# EAGLE design MSP-EXP430F5529LP (EAGLE 6.5.0)
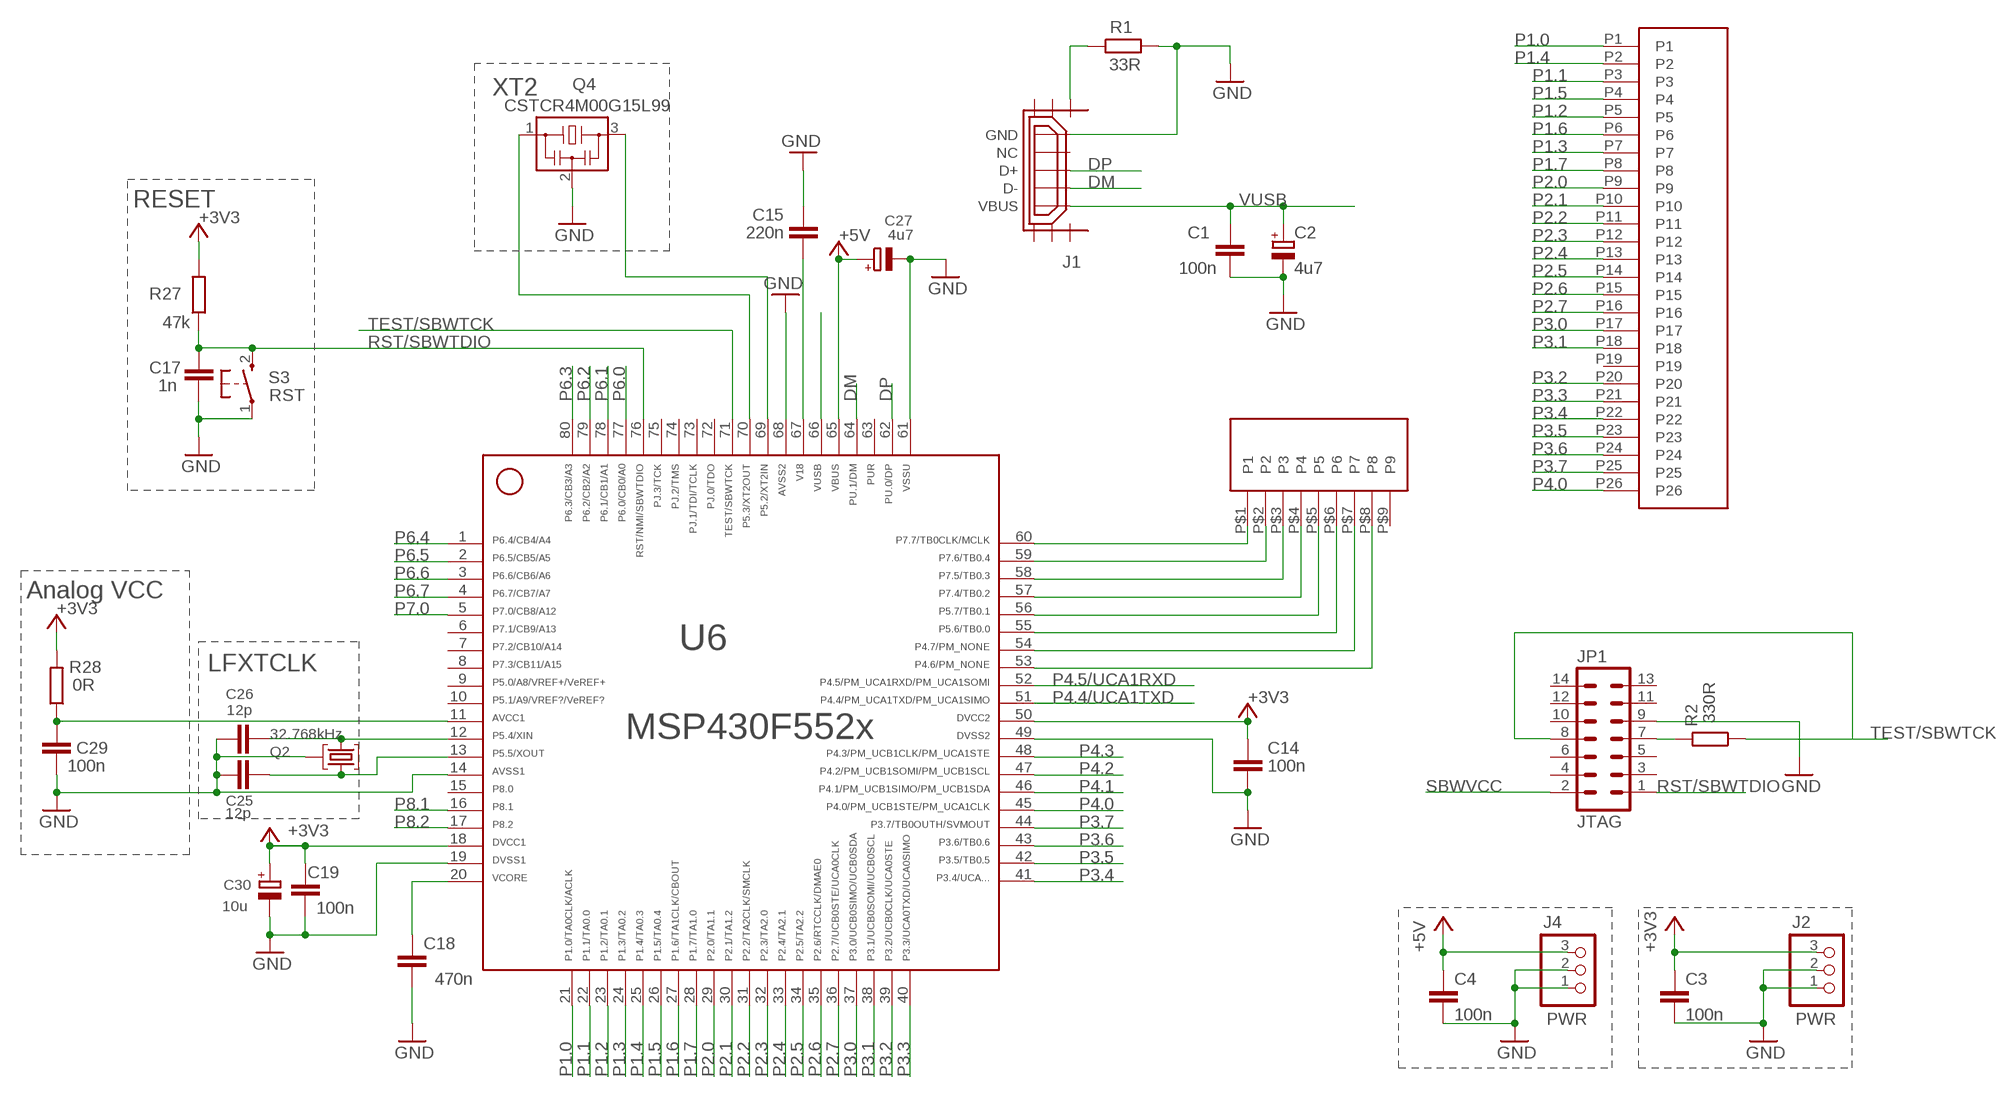
[diagram p0: schematic, sheet 1]

## Parts
C1  100n  C-EUC0402  [C0402]
C2  4u7  CPOL-EUA/3216-18R  [A/3216-18R]
C3  100n  C-EUC0402  [C0402]
C4  100n  C-EUC0402  [C0402]
C14  100n  C-EUC0402  [C0402]
C15  220n  C-EUC0402  [C0402]
C17  1n  C-EUC0402  [C0402]
C18  470n  C-EUC0402  [C0402]
C19  100n  C-EUC0402  [C0402]
C25  12p  C-EUC0402  [C0402]
C26  12p  C-EUC0402  [C0402]
C27  4u7  CPOL-EUA/3216-18R  [A/3216-18R]
C29  100n  C-EUC0402  [C0402]
C30  10u  CPOL-EUA/3216-18R  [A/3216-18R]
J1  USB_MICRO_FLIPPED  [HIROSE-ZX62R-B-5P]
J2  PWR  PINHD-1X3  [1X03]
J4  PWR  PINHD-1X3  [1X03]
JP1  JTAG  MA07-2  [MA07-2]
Q2  32.768kHz  MS3V-T1R  [MS3V-T1R]
Q4  CSTCR4M00G15L99  MURATA-FILTER_CSTCR6M00G53Z  [MURATA-FILTER_CSTCR]
R1  33R  R-EU_R0402  [R0402]
R2  330R  R-EU_R0402  [R0402]
R27  47k  R-EU_R0402  [R0402]
R28  0R  R-EU_R0402  [R0402]
S3  RST  PB  [PBTH]
U6  MSP430F5529IPNR  F552X---PN80  [PN80]
U$1  52806-0910  [SD-52806-09]
U$2  52808-267126  [SD-52808-025]

## Nets
+3V3 [Power]: C3.1 C14.1 C19.2 C30.+ J2.3 R27.2 R28.2 U6.18 U6.50
+5V [Power]: C4.1 C27.+ J4.3 U6.65
AVCC [Power]: C29.1 R28.1 U6.11
DM: J1.D- U6.64
DP: J1.D+ U6.62
GND [Ground]: C1.2 C2.- C3.2 C4.2 C14.2 C15.2 C17.2 C18.1 C19.1 C25.1 C26.1 C27.- C29.2 C30.- J1.GND J2.1 J2.2 J4.1 J4.2 JP1.9 Q2.P3(GND) Q4.2 R1.2 S3.1(P) U6.14 U6.19 U6.49 U6.61 U6.68
N$1: JP1.7 R2.2
N$9: U6.60 U$1.P$1(P1)
N$30: U6.59 U$1.P$2(P2)
N$31: U6.58 U$1.P$3(P3)
N$32: U6.57 U$1.P$4(P4)
N$33: U6.56 U$1.P$5(P5)
N$34: U6.55 U$1.P$6(P6)
N$35: U6.54 U$1.P$7(P7)
N$36: U6.53 U$1.P$8(P8)
N$39: J1.SHIELD1 R1.1
P1.0: U6.21 U$2.P1
P1.1: U6.22 U$2.P3
P1.2: U6.23 U$2.P5
P1.3: U6.24 U$2.P7
P1.4: U6.25 U$2.P2
P1.5: U6.26 U$2.P4
P1.6: U6.27 U$2.P6
P1.7: U6.28 U$2.P8
P2.0: U6.29 U$2.P9
P2.1: U6.30 U$2.P10
P2.2: U6.31 U$2.P11
P2.3: U6.32 U$2.P12
P2.4: U6.33 U$2.P13
P2.5: U6.34 U$2.P14
P2.6: U6.35 U$2.P15
P2.7: U6.36 U$2.P16
P3.0: U6.37 U$2.P17
P3.1: U6.38 U$2.P18
P3.2: U6.39 U$2.P20
P3.3: U6.40 U$2.P21
P3.4: U6.41 U$2.P22
P3.5: U6.42 U$2.P23
P3.6: U6.43 U$2.P24
P3.7: U6.44 U$2.P25
P4.0: U6.45 U$2.P26
P4.1: U6.46
P4.2: U6.47
P4.3: U6.48
P4.4/UCA1TXD: U6.51
P4.5/UCA1RXD: U6.52
P5.2/XT2IN: Q4.3 U6.69
P5.3/XT2OUT: Q4.1 U6.70
P5.4/XIN: C26.2 Q2.P2 U6.12
P5.5/XOUT: C25.2 Q2.P1 U6.13
P6.0: U6.77
P6.1: U6.78
P6.2: U6.79
P6.3: U6.80
P6.4: U6.1
P6.5: U6.2
P6.6: U6.3
P6.7: U6.4
P7.0: U6.5
P8.1: U6.16
P8.2: U6.17
RST/SBWTDIO: C17.1 JP1.1 R27.1 S3.2(S) U6.76
SBWVCC: JP1.2
TEST/SBWTCK: JP1.8 R2.1 U6.71
V18 [Power]: C15.1 U6.67
VCORE [Power]: C18.2 U6.20
VUSB [Power]: C1.1 C2.+ J1.VBUS U6.66
Unconnected: J1.NC J1.SHIELD2 J1.SHIELD3 J1.SHIELD4 J1.SHIELD5 J1.SHIELD6 JP1.3 JP1.4 JP1.5 JP1.6 JP1.10 JP1.11 JP1.12 JP1.13 JP1.14 U6.6 U6.7 U6.8 U6.9 U6.10 U6.15 U6.63 U6.72 U6.73 U6.74 U6.75 U$1.P$9(P9) U$2.P19

## Notes on the sheet
- XT2
- RESET
- Analog VCC
- LFXTCLK

## Library data of the parts
C1 C3 C4 C14 C15 C17-C19 C25 C26 C29 = rcl:C-EU: CAPACITOR, European symbol
C2 C27 C30 = rcl:CPOL-EU: POLARIZED CAPACITOR, European symbol
J1 = usb_con-update:USB_MICRO_FLIPPED
J2 J4 = pinhead:PINHD-1X3: PIN HEADER
JP1 = con-lstb:MA07-2: PIN HEADER; OC_FARNELL: unknown; OC_NEWARK: unknown
Q2 = microcrystal:MS3V-T1R
Q4 = murata:MURATA-FILTER_CSTCR: Resonator Source: murata.co.jp; MPN: CSTCR6M00G53-R0; OC_FARNELL: 1170434; OC_NEWARK: 25M8759
R1 R2 R27 R28 = rcl:R-EU_: RESISTOR, European symbol
S3 = electricalmeter:PB: OMRON SWITCH
U6 = TI_MSP430_v16_intern:F552X---PN80: ***MSP430F552X***PN80 http://www.ti.com/lit/gpn/msp430f5529 Rev1.0 06/2010 For F552X where X is 1,5,7,9
U$1 = molex-fpc:52806-0910
U$2 = molex-fpc:52808-2671: 26 PIN FPC Connector

## Net classes
0 Default: width 0.203 mm, drill 0.305 mm, clearance 0.152 mm
1 Ground: width 0.203 mm, drill 0.305 mm, clearance 0.152 mm to class 0, clearance 0.152 mm
2 Power: width 0.203 mm, drill 0.305 mm, clearance 0.152 mm to class 0, clearance 0.152 mm to class 1, clearance 0.152 mm

## Board
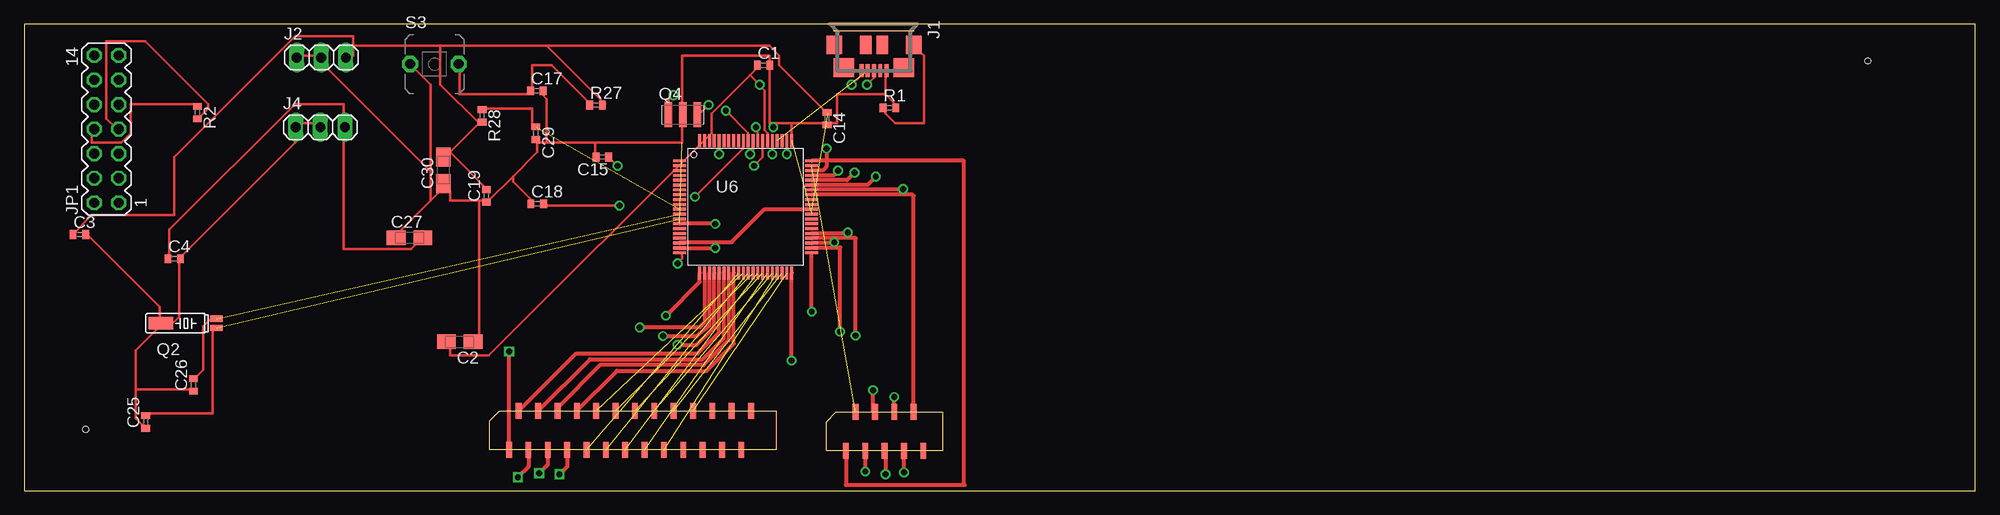
[diagram p1: board, top side]
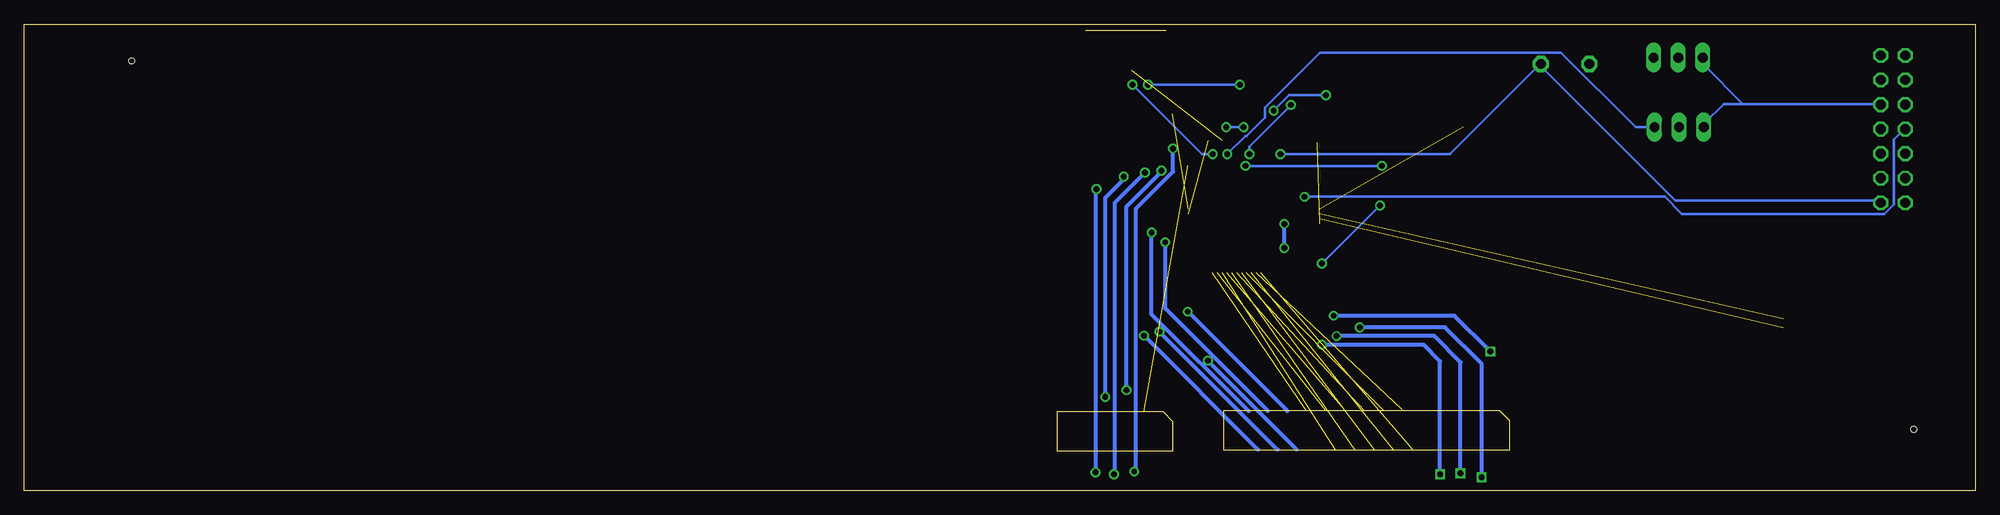
[diagram p2: board, bottom side, seen from below]

Size 201.6 x 48.25 mm. Coordinates in mm from the lower left corner, seen from the top.
Outline: 0,0 201.6,0 201.6,48.25 0,48.25 0,0
Copper layers (1*16): Top 0.035mm / dielectric 1.5mm / Bottom 0.035mm
Design rules "default": minimum track width 10mil, minimum drill 24mil, track to track 8mil, track to pad 8mil, pad to pad 8mil, via to via 8mil, smd to smd 8mil, copper to edge 40mil, drill to drill 8mil, minimum pad ring 10mil, minimum via ring 8mil, stop-mask expansion 4mil, vias tented up to drill 0mil, thermal gap 10mil
Holes 0.6 mm at 6.35,6.35 190.5,44.45

### Footprints (pad centres in the part's own frame; a part is rotated, then mirrored left to right if it is on the bottom)
C0402 = smd 0.7 x 0.9: 1 -0.65,0; 2 0.65,0
A/3216-18R = smd 1.95 x 1.5: + 1.375,0; - -1.375,0
HIROSE-ZX62R-B-5P = smd 1.35 x 0.4: D+ 2.675,0; D- 2.675,-0.65; GND 2.675,1.3; NC 2.675,0.65; VBUS 2.675,-1.3 | smd 1.9 x 1.6: SHIELD1 0,4.1; SHIELD2 0,-4.1 | smd 2 x 2.1: SHIELD3 2.35,3.1; SHIELD4 2.35,-3.1 | smd 1.9 x 1.2: SHIELD5 0,0.85; SHIELD6 0,-0.85
1X03 = drill 1.016 long: 1 -2.54,0; 2 0,0; 3 2.54,0
MA07-2 = drill 1.016 octagon: 1 -7.62,-1.27; 2 -7.62,1.27; 3 -5.08,-1.27; 4 -5.08,1.27; 5 -2.54,-1.27; 6 -2.54,1.27; 7 0,-1.27; 8 0,1.27; 9 2.54,-1.27; 10 2.54,1.27; 11 5.08,-1.27; 12 5.08,1.27; 13 7.62,-1.27; 14 7.62,1.27
MS3V-T1R = smd 0.635 x 1.27: P1 -0.47,-4.43; P2 0.47,-4.43 | smd 1.27 x 2.54: P3 0,1.3
MURATA-FILTER_CSTCR = smd 0.8 x 2.6: 1 -1.5,0; 2 0,0; 3 1.5,0
R0402 = smd 0.7 x 0.9: 1 -0.65,0; 2 0.65,0
PBTH = drill 1.016 pad 1.676 octagon: 1 -0.001,0.001; 2 5.001,0.001
PN80 = smd 1.35 x 0.3: 1 -6.825,4.75; 2 -6.825,4.25; 3 -6.825,3.75; 4 -6.825,3.25; 5 -6.825,2.75; 6 -6.825,2.25; 7 -6.825,1.75; 8 -6.825,1.25; 9 -6.825,0.75; 10 -6.825,0.25; 11 -6.825,-0.25; 12 -6.825,-0.75; 13 -6.825,-1.25; 14 -6.825,-1.75; 15 -6.825,-2.25; 16 -6.825,-2.75; 17 -6.825,-3.25; 18 -6.825,-3.75; 19 -6.825,-4.25; 20 -6.825,-4.75; 41 6.825,-4.75; 42 6.825,-4.25; 43 6.825,-3.75; 44 6.825,-3.25; 45 6.825,-2.75; 46 6.825,-2.25; 47 6.825,-1.75; 48 6.825,-1.25; 49 6.825,-0.75; 50 6.825,-0.25; 51 6.825,0.25; 52 6.825,0.75; 53 6.825,1.25; 54 6.825,1.75; 55 6.825,2.25; 56 6.825,2.75; 57 6.825,3.25; 58 6.825,3.75; 59 6.825,4.25; 60 6.825,4.75 | smd 0.3 x 1.35: 21 -4.75,-6.825; 22 -4.25,-6.825; 23 -3.75,-6.825; 24 -3.25,-6.825; 25 -2.75,-6.825; 26 -2.25,-6.825; 27 -1.75,-6.825; 28 -1.25,-6.825; 29 -0.75,-6.825; 30 -0.25,-6.825; 31 0.25,-6.825; 32 0.75,-6.825; 33 1.25,-6.825; 34 1.75,-6.825; 35 2.25,-6.825; 36 2.75,-6.825; 37 3.25,-6.825; 38 3.75,-6.825; 39 4.25,-6.825; 40 4.75,-6.825; 61 4.75,6.825; 62 4.25,6.825; 63 3.75,6.825; 64 3.25,6.825; 65 2.75,6.825; 66 2.25,6.825; 67 1.75,6.825; 68 1.25,6.825; 69 0.75,6.825; 70 0.25,6.825; 71 -0.25,6.825; 72 -0.75,6.825; 73 -1.25,6.825; 74 -1.75,6.825; 75 -2.25,6.825; 76 -2.75,6.825; 77 -3.25,6.825; 78 -3.75,6.825; 79 -4.25,6.825; 80 -4.75,6.825
SD-52806-09 = smd 0.6 x 1.65: P$1 0,0; P$2 1,4; P$3 2,0; P$4 3,4; P$5 4,0; P$6 5,4; P$7 6,0; P$8 7,4; P$9 8,0
SD-52808-025 = smd 0.6 x 1.65: P1 0,0; P2 1,4; P3 2,0; P4 3,4; P5 4,0; P6 5,4; P7 6,0; P8 7,4; P9 8,0; P10 9,4; P11 10,0; P12 11,4; P13 12,0; P14 13,4; P15 14,0; P16 15,4; P17 16,0; P18 17,4; P19 18,0; P20 19,4; P21 20,0; P22 21,4; P23 22,0; P24 23,4; P25 24,0; P26 25,4

### Placement (x,y rotation side)
C1  76.4,44 0 top
C2  45,15.4 180 top
C3  5.7,26.5 0 top
C4  15.5,24 0 top
C14  82.95,38.48 270 top
C15  59.74,34.5 180 top
C17  52.98,41.36 0 top
C18  53.01,29.67 0 top
C19  47.77,30.51 90 top
C25  12.55,7.12 90 top
C26  17.5,10.95 90 top
C27  39.82,26.17 0 top
C29  52.88,36.97 270 top
C30  43.31,33.15 90 top
J1  87.8,46.1 270 top
J2  30.7,44.8 0 top
J4  30.6,37.6 0 top
JP1  8.5,37.4 90 top
Q2  15.42,17.32 90 top
Q4  68.06,38.88 0 top
R1  89.4,39.6 0 top
R2  17.9,39.1 270 top
R27  59.08,39.87 0 top
R28  47.31,38.76 270 top
S3  39.89,44.13 0 top
U6  74.55,29.37 0 top
U$1  84.9,4.15 0 top
U$2  50.1,4.25 0 top

### Tracks (layer width: path | path; a pad name or v marks a point on that pad's centre or on a via)
+3V3  (1 unrouted)
  Top 0.254: 44,35 47,38 | 44,35 48,31 C19.2 | 44,35 C30.+ | 54,46 60,40 R27.2 | 34,46 43,46 | 43,46 54,46 | 34,46 34,45 J2.3 | 34,46 | 54,46 77,46 78,45 78,44 83,39 C14.1 | 47,38 43,42 43,46 | 47,38 R28.2 | 34,46 34,47 28,47 15.5,34.5 15.5,28.5 7,28.5 5,26.5 C3.1 | 34,46
  Top 0.406: U6.18 67.81,25.7 73.1,25.7 76.52,29.12 U6.50
+5V  (via drill 0.61)
  Top 0.254: C4.1 15,24 15,27 28,40 33,40 33,38 J4.3 33,37 33,25 40,25 41,26 C27.+ | v77.3,34.8 U6.65
  Bottom 0.254: v77.3,34.8 75.4,36.7 75.3,36.7 73.4,38.6 73.4,39.6 67.7,45.3 42.8,45.3 35.1,37.6 J4.3
AVCC  (1 unrouted)
  Top 0.254: R28.1 47.5,39.5 52.5,39.5 52.5,37.5 C29.1
DM  (1 unrouted)
DP  (via drill 0.61)
  Top 0.254: v78.8,34.8 U6.62 | v87.1,42 87.8,42.7 J1.D+
  Bottom 0.254: v78.8,34.8 79.9,34.8 v87.1,42
GND  (via drill 0.6, 0.61)  (2 unrouted)
  Top 0.254: J2.1 28,45 30,45 J2.2 31,44 42,33 | 16,24 28,36 28,37 J4.1 28,38 30,38 J4.2 | 16,24 16,18 15,17 Q2.P3 | 16,24 C4.2 | 47,30 44,30 44,31 C30.- 43,31 42,30 | 47,30 48,30 | 47,30 47,16 C2.- | 42,30 39,27 39,26 C27.- | 42,30 42,33 | 42,33 42,42 40,44 S3.1 | 89,41 90,40 R1.2 | 89,41 89,43 J1.GND | 77.4,38 77,38 77,44 | 77.4,38 79.3,38 | 79.3,38 83,38 | 89,41 84,41 84,38 83,38 | 83,38 C14.2 | 59,36 68,36 68,38 Q4.2 68,39 68,45 77,45 77,44 | 59,36 54,36 | 54,36 53,36 | 77,44 C1.2 | 50.5,32.5 53,35 53,36 | 50.5,32.5 48,30 | 48,30 C19.1 | 53,36 C29.2 | 11.5,10.5 11.5,14.5 14,17 Q2.P3 | 11.5,10.5 11.5,7.5 12.5,6.5 C25.1 | 11.5,10.5 17.5,10.5 C26.1 | C3.2 6.5,26.5 14,19 14,17.5 Q2.P3 | 50.5,32.5 50.5,32 52.5,30 C18.1 | 59,36 59,34.5 C15.2 | 54,36 54,40.5 53.5,41 C17.2 | 54,36 | U6.68 75.8,37.4 v75.6,37.6 | 77.4,38 v77.4,37.6 | 79.3,38 U6.61
  Top 0.406: U6.19 67.75,25.1 v71.4,25.1 | v71.4,27.6 71.38,27.62 U6.14
  Bottom 0.254: 24,40 26,40 28,38 J4.1 | 24,40 10,40 JP1.9 | 24,40 28,44 J2.1 | v77.4,37.6 v75.6,37.6
  Bottom 0.406: v71.4,25.1 v71.4,27.6
N$1
  Top 0.254: R2.2 18,38.5 19,39.5 19,40 12.5,46.5 8.5,46.5 8.5,38.5 9.5,37.5 JP1.7
N$9
  Top 0.406: U$1.P$1 84.9,0.6 97.2,0.6 97.1,0.7 97.1,34.1 97.08,34.12 U6.60
N$30  (1 unrouted)
N$31  (via drill 0.6)
  Top 0.406: U$1.P$3 v86.9,2 | v82.9,35.4 82.9,33.5 82.52,33.12 U6.58
  Bottom 0.406: v86.9,2 86.7,2.2 86.7,29.2 82.9,33 v82.9,35.4
N$32  (via drill 0.6)
  Top 0.406: U$1.P$4 87.7,8.35 v87.7,10.4 | v84.1,33.1 83.62,32.62 U6.57
  Bottom 0.406: v87.7,10.4 87.7,29.4 84.1,33 v84.1,33.1
N$33  (via drill 0.6)
  Top 0.406: U$1.P$5 89,4.05 v89,1.7 | v85.8,32.9 85.02,32.12 U6.56
  Bottom 0.406: v89,1.7 88.9,1.8 88.9,29.8 v85.8,32.9
N$34  (via drill 0.6)
  Top 0.406: U$1.P$6 v89.9,9.7 | v88,32.5 87.12,31.62 U6.55
  Bottom 0.406: v89.9,9.7 89.9,30.3 88,32.2 v88,32.5
N$35  (via drill 0.6)
  Top 0.406: U6.54 81.45,31.2 v90.8,31.2 | v90.9,1.9 U$1.P$7
  Bottom 0.406: v90.8,31.2 90.9,31.1 v90.9,1.9
N$36
  Top 0.406: U$1.P$8 91.9,30.5 91.78,30.62 U6.53
N$39
  Top 0.254: R1.1 89,40 89,39 90,38 93,38 93,45 92,46 J1.SHIELD1
P1.0  (via drill 0.6)
  Top 0.406: U$2.P1 v50.1,14.4 | v66.3,18.1 69.8,21.6 U6.21
  Bottom 0.406: v50.1,14.4 53.8,18.1 v66.3,18.1
P1.1  (via drill 0.6)
  Top 0.406: U$2.P3 52.1,2.5 v51,1.4 | U6.22 70.3,17.4 69.8,16.9 v63.6,16.9
  Bottom 0.406: v51,1.4 51,13.1 54.8,16.9 v63.6,16.9
P1.2  (via drill 0.6)
  Top 0.406: U$2.P5 54.1,2.7 v53.2,1.8 | v66,16 69.5,16 70.8,17.1 U6.23
  Bottom 0.406: v53.2,1.8 53.2,13.3 55.9,16 v66,16
P1.3  (via drill 0.6)
  Top 0.406: U$2.P7 56.1,2.5 v55.3,1.7 | v67.5,15.1 69.5,15.1 71.3,16.9 U6.24
  Bottom 0.406: v55.3,1.7 55.3,13.4 57,15.1 v67.5,15.1
P1.4
  Top 0.406: U$2.P2 57.05,14.2 69.6,14.2 71.8,16.4 U6.25
P1.5
  Top 0.406: U$2.P4 58.45,13.6 70.1,13.6 72.3,15.8 U6.26
P1.6
  Top 0.406: U6.27 72.8,15.6 70.2,13 59.5,13 55.1,8.6 U$2.P6
P1.7
  Top 0.406: U$2.P8 61.25,12.4 70.5,12.4 73.3,15.2 U6.28
P2.0  (1 unrouted)
P2.1  (1 unrouted)
  Top 0.406: U$2.P10 59.2,8.35
P2.2  (1 unrouted)
P2.3  (1 unrouted)
P2.4  (1 unrouted)
P2.5  (1 unrouted)
P2.6  (1 unrouted)
P2.7  (1 unrouted)
P3.0  (1 unrouted)
P3.1  (1 unrouted)
P3.2  (1 unrouted)
P3.3  (via drill 0.6)
  Top 0.406: v79.3,13.45 U6.40
  Bottom 0.406: U$2.P21 v79.3,13.45
P3.4  (via drill 0.6)
  Top 0.406: v81.38,18.52 U6.41
  Bottom 0.406: U$2.P22 v81.38,18.52
P3.5  (via drill 0.6)
  Top 0.406: v84.3,16.45 84.3,25.2 84.22,25.12 U6.42
  Bottom 0.406: U$2.P23 v84.3,16.45
P3.6  (via drill 0.6)
  Top 0.406: v83.7,25.7 83.62,25.62 U6.43
  Bottom 0.406: U$2.P24 83.7,18.85 v83.7,25.7
P3.7  (via drill 0.6)
  Top 0.406: v85.9,16.05 85.9,26.1 85.88,26.12 U6.44
  Bottom 0.406: U$2.P25 v85.9,16.05
P4.0  (via drill 0.6)
  Top 0.406: v85.1,26.7 85.02,26.62 U6.45
  Bottom 0.406: U$2.P26 85.1,18.25 v85.1,26.7
P5.2/XT2IN  (via drill 0.61)
  Top 0.254: U6.69 75.3,35.1 v75,34.8 | v70.7,39.9 69.6,38.8 Q4.3
  Bottom 0.254: v75,34.8 75,35.6 v70.7,39.9
P5.3/XT2OUT  (via drill 0.61)
  Top 0.254: U6.70 74.8,37 v72.5,39.3 | v67.1,40.9 66.6,40.4 66.6,38.9 Q4.1
  Bottom 0.254: v72.5,39.3 70.9,40.9 v67.1,40.9
P5.4/XIN  (1 unrouted)
  Top 0.254: C26.2 17.5,11.5 18.5,12.5 18.5,17 19.5,18 Q2.P2
P5.5/XOUT  (1 unrouted)
  Top 0.254: C25.2 12.5,8 19.5,8 19.5,17 Q2.P1
RST/SBWTDIO  (via drill 0.61)
  Top 0.254: S3.2 45,44 45,41 52,41 C17.1 52.5,41.5 52.5,44 54.5,44 58.5,40 R27.1 | v71.8,34.8 U6.76
  Bottom 0.254: JP1.1 10,30 31,30 45,44 S3.2 45.1,44 54.3,34.8 v71.8,34.8
TEST/SBWTCK  (via drill 0.61)
  Top 0.254: R2.1 18,40 11,40 11,37 10,36 7,36 7,37 JP1.8 | U6.71 74.3,35.4 v69.3,30.4
  Bottom 0.254: v69.3,30.4 32.1,30.4 30.3,28.6 9.4,28.6 8.4,29.6 8.4,36.3 7.3,37.4 JP1.8
V18  (via drill 0.61)
  Top 0.254: v61.3,33.6 C15.1 | v75.4,33.6 76.3,34.5 U6.67
  Bottom 0.254: v75.4,33.6 v61.3,33.6
VCORE  (via drill 0.61)
  Top 0.254: v61.5,29.5 54,29.5 C18.2 | v67.5,23.5 68,24 68,24.5 U6.20
  Bottom 0.254: v67.5,23.5 v61.5,29.5
VUSB  (via drill 0.61)
  Top 0.254: 75,43 71,39 71,37 48,14 44,14 44,15 C2.+ | 75,43 76,44 C1.1 | v85.5,42 86.5,43 J1.VBUS | 75,43 v76,42 76,41.9 76.5,41.4 76.5,37.3 76.8,37 U6.66
  Bottom 0.254: v76,42 v85.5,42